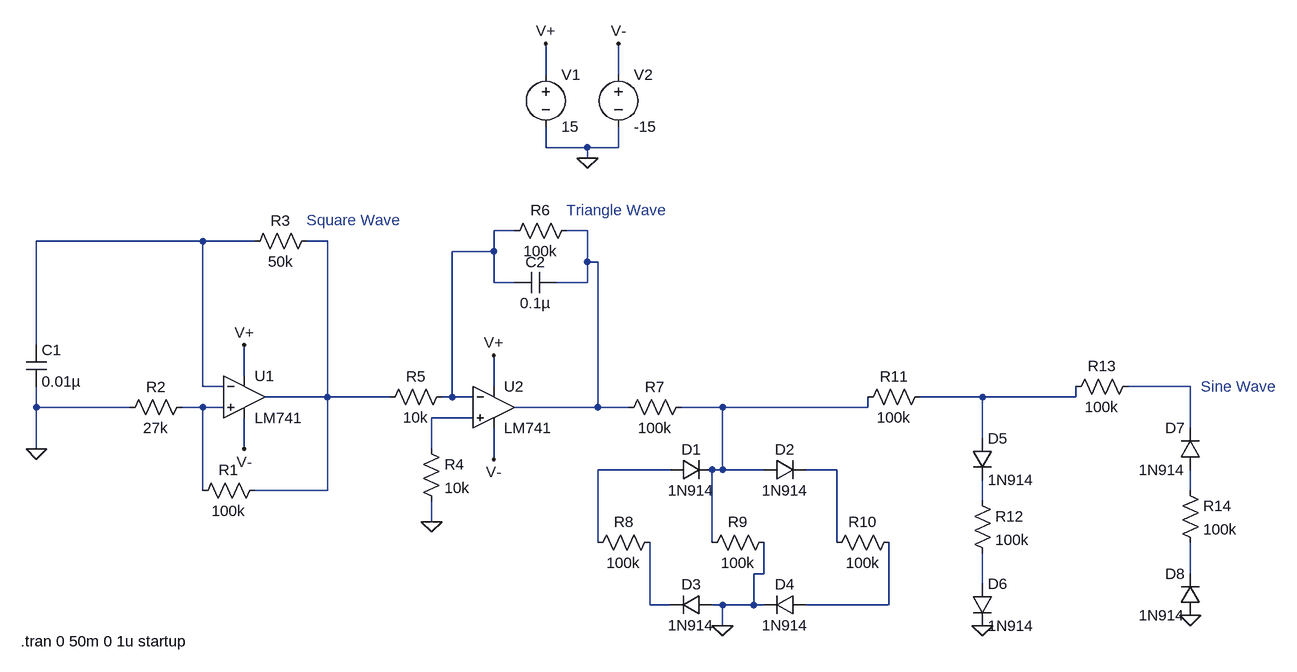
[diagram p0: schematic Function_Generator.asc]
Function_Generator.asc, the LTspice schematic file:
Version 4
SHEET 1 2000 836
WIRE 304 -320 304 -368
WIRE 416 -320 416 -368
WIRE 304 -208 304 -240
WIRE 368 -208 304 -208
WIRE 416 -208 416 -240
WIRE 416 -208 368 -208
WIRE 368 -192 368 -208
WIRE 256 -80 224 -80
WIRE 368 -80 336 -80
WIRE -224 -64 -480 -64
WIRE -144 -64 -224 -64
WIRE -32 -64 -64 -64
WIRE 224 -48 224 -80
WIRE 224 -48 160 -48
WIRE 368 -32 368 -80
WIRE 384 -32 368 -32
WIRE 224 0 224 -48
WIRE 256 0 224 0
WIRE 368 0 368 -32
WIRE 368 0 320 0
WIRE -480 96 -480 -64
WIRE -160 144 -160 96
WIRE -224 160 -224 -64
WIRE -192 160 -224 160
WIRE 224 160 224 112
WIRE 1296 160 1200 160
WIRE -32 176 -32 -64
WIRE -32 176 -128 176
WIRE 64 176 -32 176
WIRE 160 176 160 -48
WIRE 160 176 144 176
WIRE 192 176 160 176
WIRE 976 176 880 176
WIRE 1120 176 1120 160
WIRE 1120 176 976 176
WIRE -480 192 -480 160
WIRE -336 192 -480 192
WIRE -224 192 -256 192
WIRE -192 192 -224 192
WIRE 384 192 384 -32
WIRE 384 192 256 192
WIRE 432 192 384 192
WIRE 576 192 512 192
WIRE 800 192 800 176
WIRE 800 192 576 192
WIRE 192 208 128 208
WIRE 1296 224 1296 160
WIRE 976 240 976 176
WIRE -480 256 -480 192
WIRE -160 256 -160 208
WIRE 128 256 128 208
WIRE 224 272 224 224
WIRE 496 288 384 288
WIRE 576 288 576 192
WIRE 576 288 560 288
WIRE 640 288 576 288
WIRE 752 288 704 288
WIRE -224 320 -224 192
WIRE -32 320 -32 176
WIRE -32 320 -144 320
WIRE 1296 320 1296 288
WIRE 976 336 976 304
WIRE 128 368 128 336
WIRE 384 400 384 288
WIRE 560 400 560 288
WIRE 752 400 752 288
WIRE 640 448 640 400
WIRE 640 448 624 448
WIRE 1296 448 1296 400
WIRE 976 464 976 416
WIRE 464 496 464 400
WIRE 496 496 464 496
WIRE 576 496 560 496
WIRE 624 496 624 448
WIRE 624 496 576 496
WIRE 640 496 624 496
WIRE 832 496 832 400
WIRE 832 496 704 496
WIRE 576 528 576 496
FLAG -160 96 V+
FLAG 224 112 V+
FLAG 304 -368 V+
FLAG -160 256 V-
FLAG 224 272 V-
FLAG 416 -368 V-
FLAG 368 -192 0
FLAG -480 256 0
FLAG 128 368 0
FLAG 576 528 0
FLAG 976 528 0
FLAG 1296 512 0
DATAFLAG -32 32 ""
DATAFLAG -32 32 ""
SYMBOL voltage 304 -336 R0
WINDOW 123 0 0 Left 0
WINDOW 39 0 0 Left 0
SYMATTR InstName V1
SYMATTR Value 15
SYMBOL voltage 416 -336 R0
WINDOW 123 0 0 Left 0
WINDOW 39 0 0 Left 0
SYMATTR InstName V2
SYMATTR Value -15
SYMBOL res -128 304 R90
WINDOW 0 0 56 VBottom 2
WINDOW 3 32 56 VTop 2
SYMATTR InstName R1
SYMATTR Value 100k
SYMBOL res -240 176 R90
WINDOW 0 0 56 VBottom 2
WINDOW 3 32 56 VTop 2
SYMATTR InstName R2
SYMATTR Value 27k
SYMBOL res -48 -80 R90
WINDOW 0 0 56 VBottom 2
WINDOW 3 32 56 VTop 2
SYMATTR InstName R3
SYMATTR Value 50k
SYMBOL cap -496 96 R0
SYMATTR InstName C1
SYMATTR Value 0.01µ
SYMBOL res 112 240 R0
SYMATTR InstName R4
SYMATTR Value 10k
SYMBOL res 160 160 R90
WINDOW 0 0 56 VBottom 2
WINDOW 3 32 56 VTop 2
SYMATTR InstName R5
SYMATTR Value 10k
SYMBOL res 352 -96 R90
WINDOW 0 0 56 VBottom 2
WINDOW 3 32 56 VTop 2
SYMATTR InstName R6
SYMATTR Value 100k
SYMBOL cap 320 -16 R90
WINDOW 0 0 32 VBottom 2
WINDOW 3 32 32 VTop 2
SYMATTR InstName C2
SYMATTR Value 0.1µ
SYMBOL res 528 176 R90
WINDOW 0 0 56 VBottom 2
WINDOW 3 32 56 VTop 2
SYMATTR InstName R7
SYMATTR Value 100k
SYMBOL OpAmps\\LM741 -160 112 R0
SYMATTR InstName U1
SYMBOL OpAmps\\LM741 224 128 R0
SYMATTR InstName U2
SYMBOL diode 496 304 R270
WINDOW 0 32 32 VTop 2
WINDOW 3 0 32 VBottom 2
SYMATTR InstName D1
SYMATTR Value 1N914
SYMBOL diode 640 304 R270
WINDOW 0 32 32 VTop 2
WINDOW 3 0 32 VBottom 2
SYMATTR InstName D2
SYMATTR Value 1N914
SYMBOL res 480 384 R90
WINDOW 0 0 56 VBottom 2
WINDOW 3 32 56 VTop 2
SYMATTR InstName R8
SYMATTR Value 100k
SYMBOL res 656 384 R90
WINDOW 0 0 56 VBottom 2
WINDOW 3 32 56 VTop 2
SYMATTR InstName R9
SYMATTR Value 100k
SYMBOL res 848 384 R90
WINDOW 0 0 56 VBottom 2
WINDOW 3 32 56 VTop 2
SYMATTR InstName R10
SYMATTR Value 100k
SYMBOL diode 560 480 R90
WINDOW 0 0 32 VBottom 2
WINDOW 3 32 32 VTop 2
SYMATTR InstName D3
SYMATTR Value 1N914
SYMBOL diode 704 480 R90
WINDOW 0 0 32 VBottom 2
WINDOW 3 32 32 VTop 2
SYMATTR InstName D4
SYMATTR Value 1N914
SYMBOL res 896 160 R90
WINDOW 0 0 56 VBottom 2
WINDOW 3 32 56 VTop 2
SYMATTR InstName R11
SYMATTR Value 100k
SYMBOL diode 960 240 R0
SYMATTR InstName D5
SYMATTR Value 1N914
SYMBOL res 960 320 R0
SYMATTR InstName R12
SYMATTR Value 100k
SYMBOL diode 960 464 R0
SYMATTR InstName D6
SYMATTR Value 1N914
SYMBOL res 1216 144 R90
WINDOW 0 0 56 VBottom 2
WINDOW 3 32 56 VTop 2
SYMATTR InstName R13
SYMATTR Value 100k
SYMBOL diode 1312 288 R180
WINDOW 0 24 64 Left 2
WINDOW 3 24 0 Left 2
SYMATTR InstName D7
SYMATTR Value 1N914
SYMBOL res 1280 304 R0
SYMATTR InstName R14
SYMATTR Value 100k
SYMBOL diode 1312 512 R180
WINDOW 0 24 64 Left 2
WINDOW 3 24 0 Left 2
SYMATTR InstName D8
SYMATTR Value 1N914
TEXT -64 -96 Left 2 ;Square Wave
TEXT 336 -112 Left 2 ;Triangle Wave
TEXT 1312 160 Left 2 ;Sine Wave
TEXT -504 552 Left 2 !.tran 0 50m 0 1u startup

The netlist it stands for:
* Function_Generator.asc
V1 V+ 0 15
V2 V- 0 -15
R1 N004 N007 100k
R2 N007 0 27k
R3 N004 N003 50k
C1 N003 0 0.01µ
R4 N009 0 10k
R5 N001 N004 10k
R6 N002 N001 100k
C2 N002 N001 0.1µ
R7 N008 N002 100k
XU1 N007 N003 V+ V- N004 LM741  ; pins In+ In- V+ V- OUT
XU2 N009 N001 V+ V- N002 LM741  ; pins In+ In- V+ V- OUT
D1 N010 N008 1N914
D2 N008 N011 1N914
R8 N016 N010 100k
R9 0 N008 100k
R10 N017 N011 100k
D3 0 N016 1N914
D4 N017 0 1N914
R11 N006 N008 100k
D5 N006 N013 1N914
R12 N013 N015 100k
D6 N015 0 1N914
R13 N005 N006 100k
D7 N012 N005 1N914
R14 N012 N014 100k
D8 0 N014 1N914
.model D D
.lib standard.dio
* Square Wave
* Triangle Wave
* Sine Wave
.tran 0 50m 0 1u startup
.lib LM741.lib
.backanno
.end